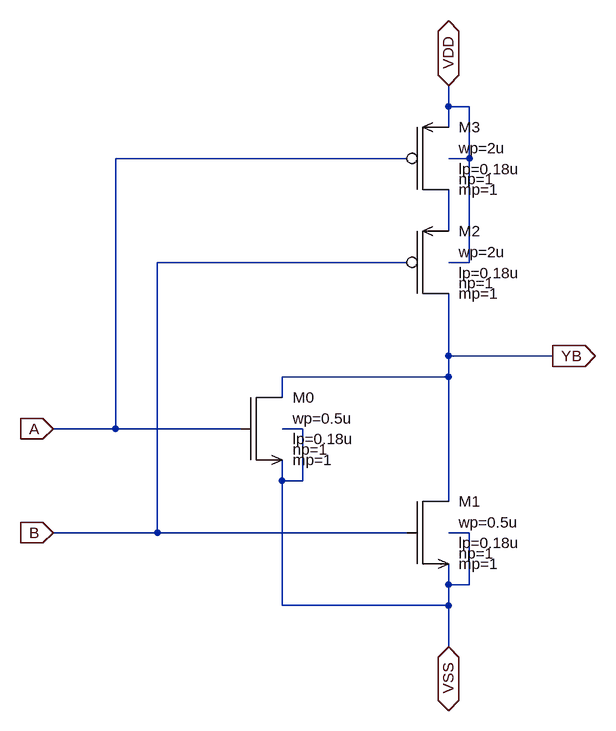
[diagram p0: schematic nr21.asc]
nr21.asc, the LTspice schematic file:
Version 4
SHEET 1 944 1056
WIRE 704 128 704 96
WIRE 736 128 704 128
WIRE 704 160 704 128
WIRE 640 208 192 208
WIRE 736 208 736 128
WIRE 736 208 704 208
WIRE 704 320 704 256
WIRE 640 368 256 368
WIRE 736 368 736 208
WIRE 736 368 704 368
WIRE 704 512 704 416
WIRE 864 512 704 512
WIRE 704 544 704 512
WIRE 704 544 448 544
WIRE 448 576 448 544
WIRE 192 624 192 208
WIRE 192 624 96 624
WIRE 384 624 192 624
WIRE 480 624 448 624
WIRE 448 704 448 672
WIRE 480 704 480 624
WIRE 480 704 448 704
WIRE 704 736 704 544
WIRE 256 784 256 368
WIRE 256 784 96 784
WIRE 640 784 256 784
WIRE 736 784 704 784
WIRE 704 864 704 832
WIRE 736 864 736 784
WIRE 736 864 704 864
WIRE 448 896 448 704
WIRE 704 896 704 864
WIRE 704 896 448 896
WIRE 704 960 704 896
FLAG 864 512 YB
IOPIN 864 512 Out
FLAG 704 960 VSS
IOPIN 704 960 BiDir
FLAG 704 96 VDD
IOPIN 704 96 BiDir
FLAG 96 784 B
IOPIN 96 784 In
FLAG 96 624 A
IOPIN 96 624 In
SYMBOL ptm180_pmos1p8 640 208 R0
SYMATTR InstName M3
SYMATTR Value wp=2u
SYMATTR Value2 lp=0.18u
SYMBOL ptm180_pmos1p8 640 368 R0
SYMATTR InstName M2
SYMATTR Value wp=2u
SYMATTR Value2 lp=0.18u
SYMBOL ptm180_nmos1p8 640 784 R0
SYMATTR InstName M1
SYMATTR Value wp=0.5u
SYMATTR Value2 lp=0.18u
SYMBOL ptm180_nmos1p8 384 624 R0
SYMATTR InstName M0
SYMATTR Value wp=0.5u
SYMATTR Value2 lp=0.18u

The netlist it stands for:
* nr21.asc
XM3 N001 A VDD VDD ptm180_pmos1p8 wp=2u lp=0.18u np=1 mp=1  ; pins ND NG NS NB
XM2 YB B N001 VDD ptm180_pmos1p8 wp=2u lp=0.18u np=1 mp=1  ; pins ND NG NS NB
XM1 YB B VSS VSS ptm180_nmos1p8 wp=0.5u lp=0.18u np=1 mp=1  ; pins ND NG NS NB
XM0 YB A VSS VSS ptm180_nmos1p8 wp=0.5u lp=0.18u np=1 mp=1  ; pins ND NG NS NB
.lib FREE180nm.model
.backanno
.end